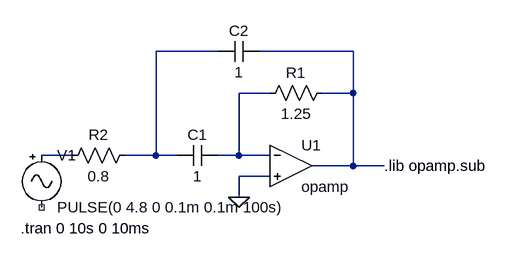
[diagram p0: schematic P4.asc]
P4.asc, the LTspice schematic file:
Version 4.1
SHEET 1 880 680
WIRE 144 -32 48 -32
WIRE 352 -32 208 -32
WIRE 224 32 176 32
WIRE 352 32 352 -32
WIRE 352 32 304 32
WIRE -80 128 -128 128
WIRE 48 128 48 -32
WIRE 48 128 0 128
WIRE 80 128 48 128
WIRE 176 128 176 32
WIRE 176 128 144 128
WIRE 224 128 176 128
WIRE 352 144 352 32
WIRE 352 144 288 144
WIRE 400 144 352 144
WIRE 224 160 176 160
WIRE 176 192 176 160
FLAG 176 192 0
SYMBOL OpAmps\\opamp 256 80 R0
SYMATTR InstName U1
SYMBOL cap 80 144 R270
WINDOW 0 32 32 VTop 2
WINDOW 3 0 32 VBottom 2
SYMATTR InstName C1
SYMATTR Value 1
SYMBOL cap 144 -16 R270
WINDOW 0 32 32 VTop 2
WINDOW 3 0 32 VBottom 2
SYMATTR InstName C2
SYMATTR Value 1
SYMBOL res 320 16 R90
WINDOW 0 0 56 VBottom 2
WINDOW 3 32 56 VTop 2
SYMATTR InstName R1
SYMATTR Value 1.25
SYMBOL res 16 112 R90
WINDOW 0 0 56 VBottom 2
WINDOW 3 32 56 VTop 2
SYMATTR InstName R2
SYMATTR Value 0.8
SYMBOL Misc\\signal -128 112 R0
WINDOW 123 0 0 Left 0
WINDOW 39 0 0 Left 0
SYMATTR InstName V1
SYMATTR Value PULSE(0 4.8 0 0.1m 0.1m 100s)
TEXT 400 144 Left 2 !.lib opamp.sub
TEXT -160 240 Left 2 !.tran 0 10s 0 10ms

The netlist it stands for:
* P4.asc
X§U1 N003 0 N002 opamp Aol=100K GBW=10Meg  ; pins invin noninvin out
C1 N001 N003 1
C2 N001 N002 1
R1 N002 N003 1.25
R2 N001 N004 0.8
V1 N004 NC_01 PULSE(0 4.8 0 0.1m 0.1m 100s)
.lib opamp.sub
.tran 0 10s 0 10ms
.backanno
.end